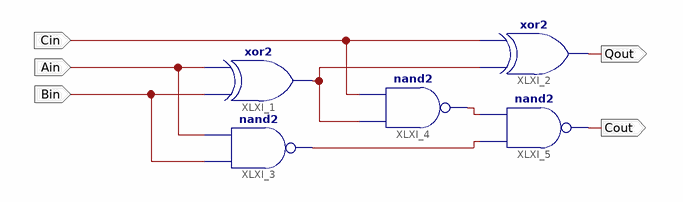
[diagram p0: schematic sheet 1]
// Xilinx ISE schematic FA.sch (spartan3e) as structural Verilog: 5 symbols, 5 ports
module FA (
  input  Cin,
  input  Ain,
  input  Bin,
  output Qout,
  output Cout
);

  wire XLXN_12, XLXN_18, XLXN_22;

  xor XLXI_1 (XLXN_12, Bin, Ain);
  xor XLXI_2 (Qout, XLXN_12, Cin);
  nand XLXI_3 (XLXN_22, Bin, Ain);
  nand XLXI_4 (XLXN_18, XLXN_12, Cin);
  nand XLXI_5 (Cout, XLXN_22, XLXN_18);
endmodule
